# EasyEDA schematic easyeda system.json
TITLE: Sheet_1; REV: 1.0; Date: 2025-07-09; Sheet: 1/1; Company: Your Company
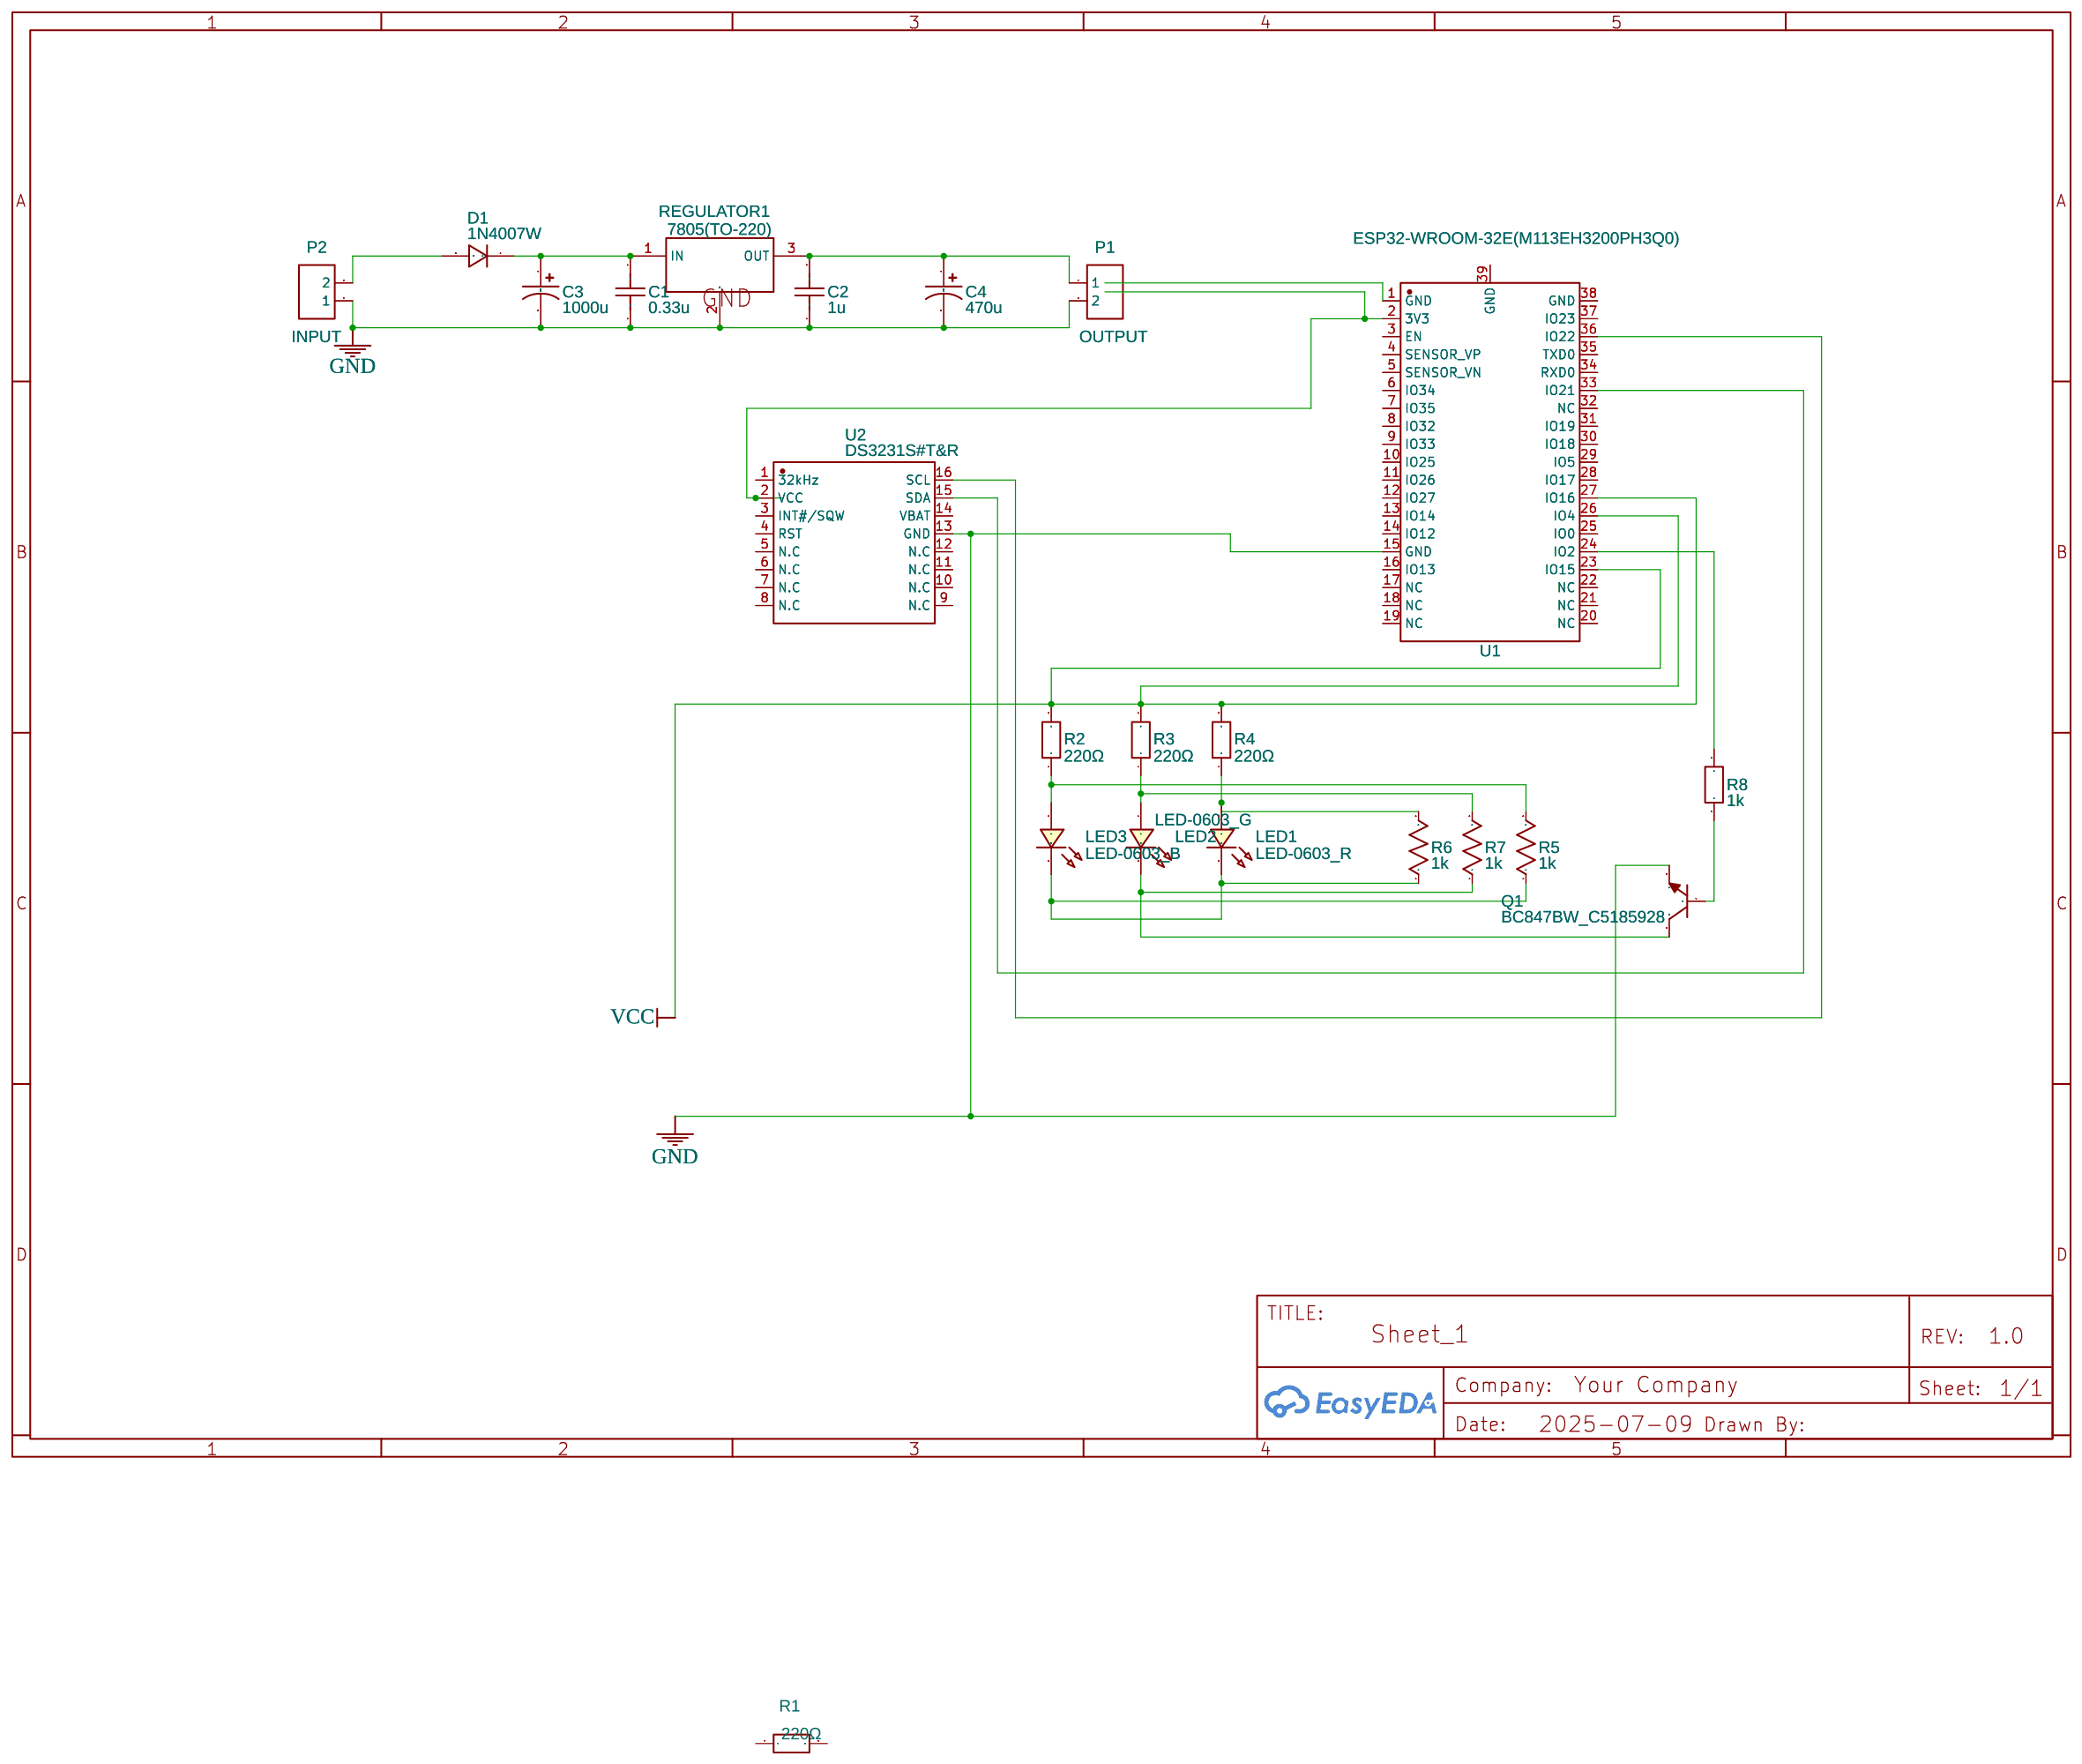
[diagram p0: schematic sheet]

## Parts
C1  0.33u  [RAD-0.1]
C2  1u  [RAD-0.1]
C3  1000u  [CAP-D3.0×F1.5]
C4  470u  [CAP-D3.0×F1.5]
D1  1N4007W  [SOD-123_L2.8-W1.8-LS3.7-RD]
LED1  LED-0603_R  [LED0603_RED]
LED2  LED-0603_G  [LED0603_GREEN]
LED3  LED-0603_B  [LED0603_BLUE]
P1  OUTPUT  [CONN-TH_2P-P5.00]
P2  INPUT  [CONN-TH_2P-P5.00]
Q1  BC847BW_C5185928  [SOT-323-3_L2.1-W1.3-P1.30-LS2.3-BR]
R1  220Ω  [RES-SMD_L28.6-W12.0_OHMITE_RWS10]
R2  220Ω  [RES-SMD_L28.6-W12.0_OHMITE_RWS10]
R3  220Ω  [RES-SMD_L28.6-W12.0_OHMITE_RWS10]
R4  220Ω  [RES-SMD_L28.6-W12.0_OHMITE_RWS10]
R5  1k  [R0603]
R6  1k  [R0603]
R7  1k  [R0603]
R8  1k  [R0603]
REGULATOR1  7805(TO-220)  [TO-220-3_L10.0-W4.5-P2.54-L]
U1  ESP32-WROOM-32E(M113EH3200PH3Q0)  [WIFI-SMD_ESP32-WROOM-32E]
U2  DS3231S#T&R  [SOIC-16_L10.3-W7.5-P1.27-LS10.3-BL]

## Library data of the parts
C1 C2 = C_RAD-0.1_US: Contributor: LCEDA_Lib
C3 C4 = CE_TH_D3.0×F1.5_US: Contributor: LCEDA_Lib
D1 = 1N4007W: Supplier: LCSC; Supplier Part: C328592; Manufacturer: BLUE ROCKET; Contributor: LCEDA_Lib
LED1 = LED-0603_R: Manufacturer: EVERLIGHT(台湾亿光); Manufacturer Part: 19-217/R6C-AL1M2VY/3T; Supplier Part: C72044; Supplier: LCSC; Contributor: LCEDA_01
LED2 = LED-0603_G: Manufacturer: EVERLIGHT(台湾亿光); Manufacturer Part: 19-217/GHC-YR1S2/3T; Supplier Part: C72043; Supplier: LCSC; Contributor: LCEDA_Lib
LED3 = LED-0603_B: Manufacturer: EVERLIGHT(台湾亿光); Manufacturer Part: 19-217/BHC-ZL1M2RY/3T; Supplier Part: C72041; Supplier: LCSC; Contributor: LCEDA_01
P1 P2 = CONN-TH_2P-P5.00: Supplier: LCSC; Contributor: LCEDA_Lib
Q1 = BC847BW_C5185928: Contributor: lcsc; Supplier: LCSC; Supplier Part: C5185928; Manufacturer: Slkor(萨科微); Manufacturer Part: BC847BW; JLCPCB Part Class: Extended Part
R1-R4 = RWS10 220R J TR: Supplier: LCSC; Supplier Part: C6460769; Manufacturer: Ohmite; Contributor: lcsc; JLCPCB Part Class: Extended Part
R5-R7 = R_0603_US: Contributor: LCEDA_Lib
R8 = R_0603_EU: Contributor: LCEDA_Lib
REGULATOR1 = 7805(TO-220): Supplier: LCSC; Manufacturer: STMicroelectronics; Manufacturer Part: L7805CV-DG; Supplier Part: C3795; Contributor: LCEDA_Lib
U1 = ESP32-WROOM-32E(M113EH3200PH3Q0): Supplier: LCSC; Supplier Part: C6616614; Manufacturer: ESPRESSIF(乐鑫); Contributor: lcsc; JLCPCB Part Class: Extended Part
U2 = DS3231S#T&amp;R: Contributor: LCSC; Supplier: LCSC; Supplier Part: C2651514; Manufacturer: ADI(亚德诺)/MAXIM(美信); JLCPCB Part Class: Extended Part

## Nets
GND: C1.2 C2.1 C3.2 C4.2 P1.2 P2.1 Q1.2(E) REGULATOR1.2(GND) U1.15(GND) U2.13(GND)
VCC: R2.2 R3.2 R4.2 U1.23(IO15) U1.26(IO4) U1.27(IO16)
Net-(C1-1): C1.1 C3.1 D1.1 REGULATOR1.1(IN)
Net-(C2-2): C2.2 C4.1 P1.1 REGULATOR1.3(OUT)
Net-(D1-2): D1.2 P2.2
Net-(LED1-1): LED1.1 R4.1 R6.2
Net-(LED1-2): LED1.2 LED3.2 R5.1 R6.1
Net-(LED2-1): LED2.1 R3.1 R7.2
Net-(LED2-2): LED2.2 Q1.3(C) R7.1
Net-(LED3-1): LED3.1 R2.1 R5.2
Net-(Q1-1): Q1.1(B) R8.1
Net-(R8-2): R8.2 U1.24(IO2)
Net-(U1-2): U1.2(3V3) U2.2(VCC)
Net-(U1-33): U1.33(IO21) U2.15(SDA)
Net-(U1-36): U1.36(IO22) U2.16(SCL)

Not connected (* = marked no-connect by the designer): R1 1 2; U1 1(GND) 3(EN) 4(SENSOR_VP) 5(SENSOR_VN) 6(IO34) 7(IO35) 8(IO32) 9(IO33) 10(IO25) 11(IO26) 12(IO27) 13(IO14) 14(IO12) 16(IO13) 17(NC) 18(NC) 19(NC) 20(NC) 21(NC) 22(NC) 25(IO0) 28(IO17) 29(IO5) 30(IO18) 31(IO19) 32(NC) 34(RXD0) 35(TXD0) 37(IO23) 38(GND) 39(GND); U2 1(32kHz) 3(INT#/SQW) 4(RST) 5(N.C) 6(N.C) 7(N.C) 8(N.C) 9(N.C) 10(N.C) 11(N.C) 12(N.C) 14(VBAT)
